# EAGLE design avga (EAGLE 5.09)
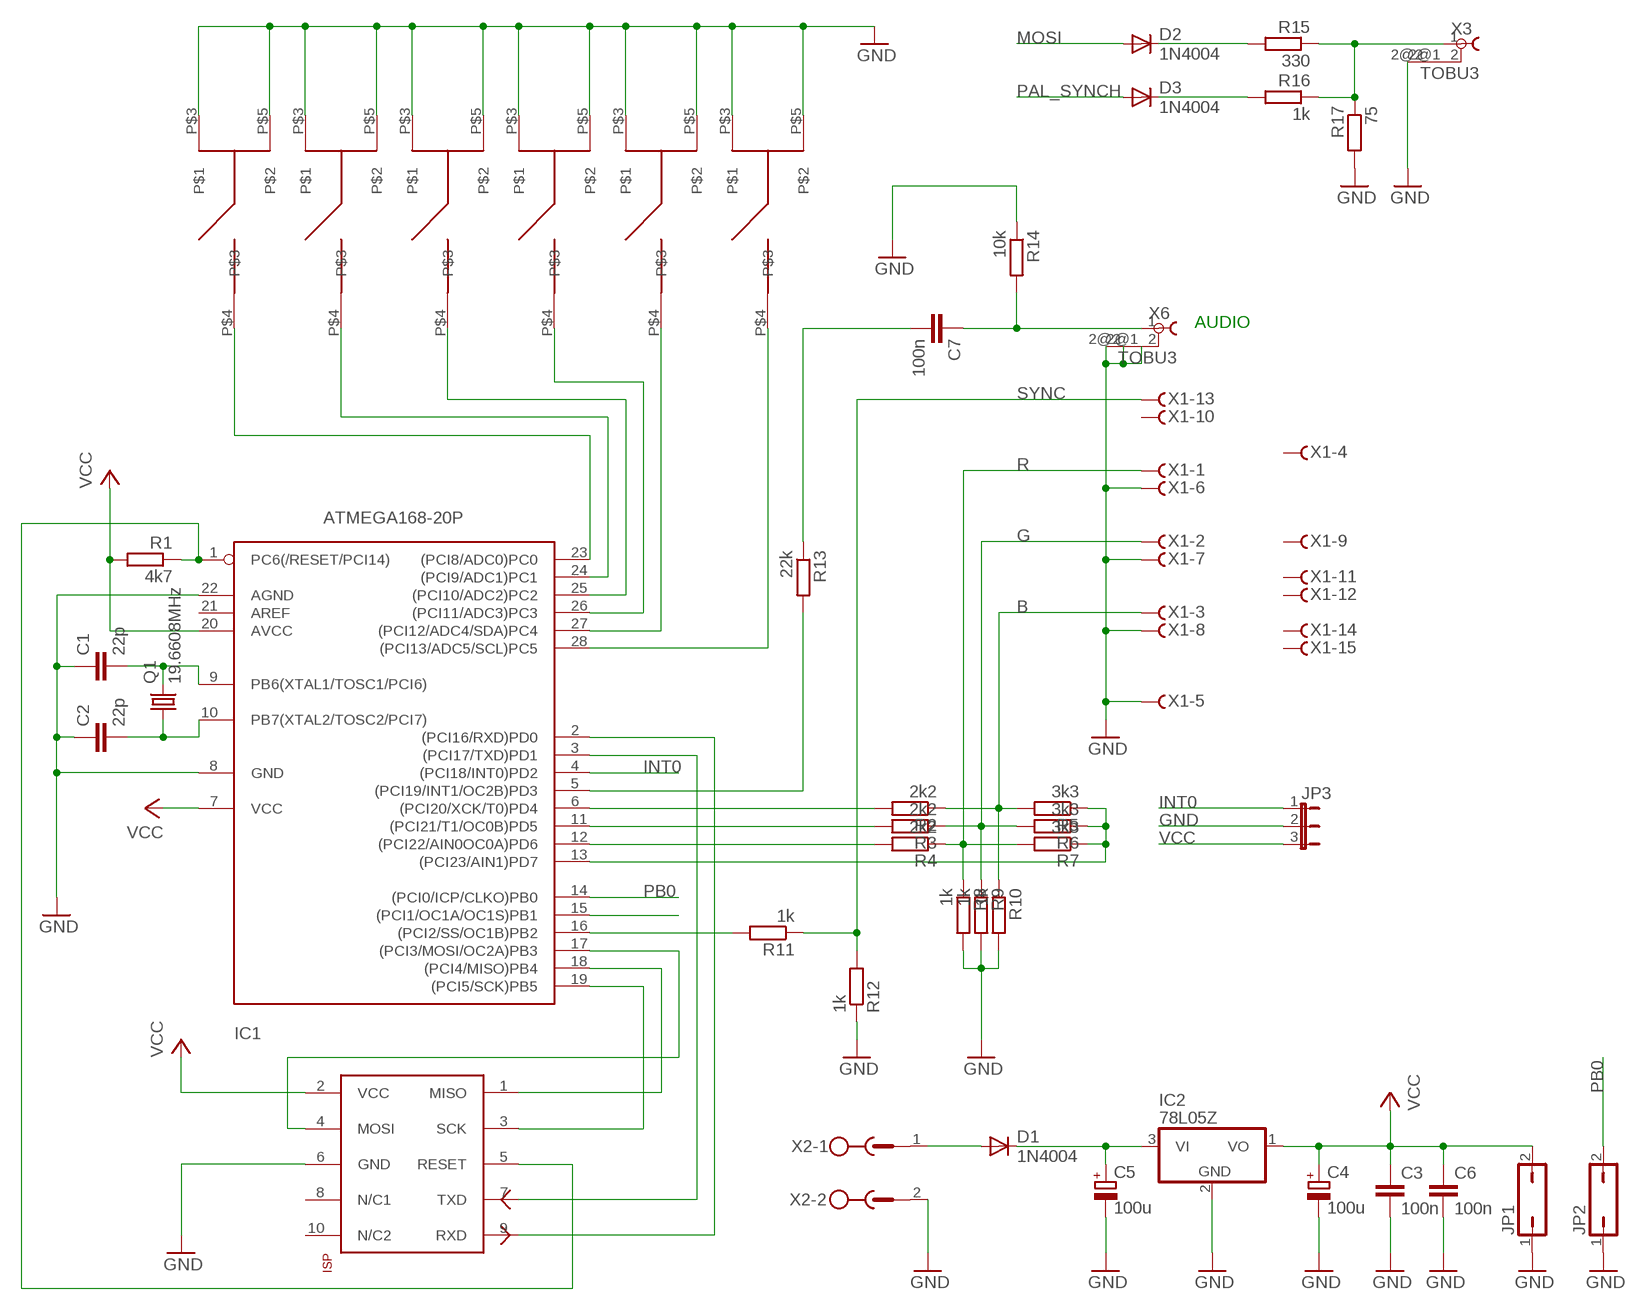
[diagram p0: schematic, sheet 1]

## Parts
C1  22p  C-EU050-025X075  [C050-025X075]
C2  22p  C-EU050-025X075  [C050-025X075]
C3  100n  C-EU050-025X075  [C050-025X075]
C4  100u  CPOL-EUE5-8.5  [E5-8,5]
C5  100u  CPOL-EUE5-8.5  [E5-8,5]
C6  100n  C-EU050-025X075  [C050-025X075]
C7  100n  C-EU050-025X075  [C050-025X075]
D1  1N4004  [DO41-10]
D2  1N4004  [DO41-10]
D3  1N4004  [DO41-10]
IC1  ATMEGA168-20P  [DIL28-3]
IC2  78L05Z  [TO92]
JP1  JP1Q  [JP1]
JP2  JP1Q  [JP1]
JP3  JP2E  [JP2]
Q1  19.6608MHz  CRYTALHC49U-V  [HC49U-V]
R1  4k7  R-EU_0204/7  [0204/7]
R2  2k2  R-EU_0204/7  [0204/7]
R3  2k2  R-EU_0204/7  [0204/7]
R4  2k2  R-EU_0204/7  [0204/7]
R5  3k3  R-EU_0204/7  [0204/7]
R6  3k3  R-EU_0204/7  [0204/7]
R7  3k3  R-EU_0204/7  [0204/7]
R8  1k  R-EU_0204/7  [0204/7]
R9  1k  R-EU_0204/7  [0204/7]
R10  1k  R-EU_0204/7  [0204/7]
R11  1k  R-EU_0204/7  [0204/7]
R12  1k  R-EU_0204/7  [0204/7]
R13  22k  R-EU_0204/7  [0204/7]
R14  10k  R-EU_0204/7  [0204/7]
R15  330  R-EU_0204/7  [0204/7]
R16  1k  R-EU_0204/7  [0204/7]
R17  75  R-EU_0204/7  [0204/7]
U$1  KEYBUTTON  [KEYBUTTON]
U$2  KEYBUTTON  [KEYBUTTON]
U$3  KEYBUTTON  [KEYBUTTON]
U$4  KEYBUTTON  [KEYBUTTON]
U$5  KEYBUTTON  [KEYBUTTON]
U$6  KEYBUTTON  [KEYBUTTON]
U$7  CON-ISP  [CON-ISP]
X1  HF15HS  [HDF15H]
X2  MSTBV2  [MSTBV2]
X3  TOBU3  [TOBU3]
X6  TOBU3  [TOBU3]

## Nets
B: R2.1 R5.2 R10.1 X1.3
G: R3.1 R6.2 R9.1 X1.2
GND: C1.1 C2.1 C3.2 C4.- C5.- C6.2 IC1.8(GND) IC1.22(AGND) IC2.2(GND) JP1.1 JP2.1 JP3.2 R8.2 R9.2 R10.2 R12.1 R14.1 R17.2 U$1.P$3 U$1.P$5 U$2.P$3 U$2.P$5 U$3.P$3 U$3.P$5 U$4.P$3 U$4.P$5 U$5.P$3 U$5.P$5 U$6.P$3 U$6.P$5 U$7.6(GND) X1.5 X1.6 X1.7 X1.8 X2.2 X3.2@2 X6.2 X6.2@1 X6.2@2
INT0: IC1.4((PCI18/INT0)PD2) JP3.1
MC_SYNCH: IC1.16((PCI2/SS/OC1B)PB2) R11.2
MISO: IC1.18((PCI4/MISO)PB4) U$7.1(MISO)
MOSI: D2.A IC1.17((PCI3/MOSI/OC2A)PB3) U$7.4(MOSI)
N$1: C1.2 IC1.9(PB6(XTAL1/TOSC1/PCI6)) Q1.2
N$3: C2.2 IC1.10(PB7(XTAL2/TOSC2/PCI7)) Q1.1
N$4: IC1.11((PCI21/T1/OC0B)PD5) R3.2
N$5: IC1.6((PCI20/XCK/T0)PD4) R2.2
N$6: IC1.12((PCI22/AIN0OC0A)PD6) R4.2
N$7: IC1.13((PCI23/AIN1)PD7) R5.1 R6.1 R7.1
N$8: D1.A X2.1
N$9: IC1.23((PCI8/ADC0)PC0) U$6.P$4
N$10: IC1.24((PCI9/ADC1)PC1) U$5.P$4
N$11: IC1.25((PCI10/ADC2)PC2) U$4.P$4
N$12: C5.+ D1.C IC2.3(VI)
N$13: IC1.26((PCI11/ADC3)PC3) U$3.P$4
N$15: IC1.27((PCI12/ADC4/SDA)PC4) U$2.P$4
N$16: IC1.28((PCI13/ADC5/SCL)PC5) U$1.P$4
N$17: IC1.5((PCI19/INT1/OC2B)PD3) R13.2
N$18: C7.2 R13.1
N$19: C7.1 R14.2 X6.1
N$20: D2.C R15.2
N$21: D3.C R16.2
N$22: R15.1 R16.1 R17.1 X3.1
PAL_SYNCH: D3.A IC1.15((PCI1/OC1A/OC1S)PB1)
PB0: IC1.14((PCI0/ICP/CLKO)PB0) JP2.2
R: R4.1 R7.2 R8.1 X1.1
RESET: IC1.1(PC6(/RESET/PCI14)) R1.1 U$7.5(RESET)
RXD: IC1.2((PCI16/RXD)PD0) U$7.9(RXD)
SCK: IC1.19((PCI5/SCK)PB5) U$7.3(SCK)
SYNC: R11.1 R12.2 X1.13
TXD: IC1.3((PCI17/TXD)PD1) U$7.7(TXD)
VCC: C3.1 C4.+ C6.1 IC1.7(VCC) IC1.20(AVCC) IC2.1(VO) JP1.2 JP3.3 R1.2 U$7.2(VCC)
Unconnected: IC1.21(AREF) U$7.8(N/C1) U$7.10(N/C2) X1.4 X1.9 X1.10 X1.11 X1.12 X1.14 X1.15 X3.2 X3.2@1

## Notes on the sheet
- AUDIO

## Library data of the parts
C1-C3 C6 C7 = rcl:C-EU: CAPACITOR, European symbol
C4 C5 = rcl:CPOL-EU: POLARIZED CAPACITOR, European symbol
D1-D3 = diode:1N4004: DIODE general purpose rectifier, 1 A
IC1 = avr:ATMEGA168*P: MICROCONTROLLER 16 kBytes FLASH 1 kBytes SRAM 512 Bytes EEPROM USART 8-channel 10 bit ADC
IC2 = linear:78*: Positive VOLTAGE REGULATOR
JP1 JP2 = jumper:JP1Q: JUMPER
JP3 = jumper:JP2E: JUMPER
Q1 = crystal:CRYTAL: CRYSTAL
R1-R17 = rcl:R-EU_: RESISTOR, European symbol
U$1-U$6 = keybutton:KEYBUTTON
U$7 = con-isp:CON-ISP
X1 = con-subd:HF15?S: SUB-D
X2 = con-phoenix-500:MSTBV2: PHOENIX
X3 X6 = con-hirschmann:TOBU3: Female Cinch CONNECTOR

## Board
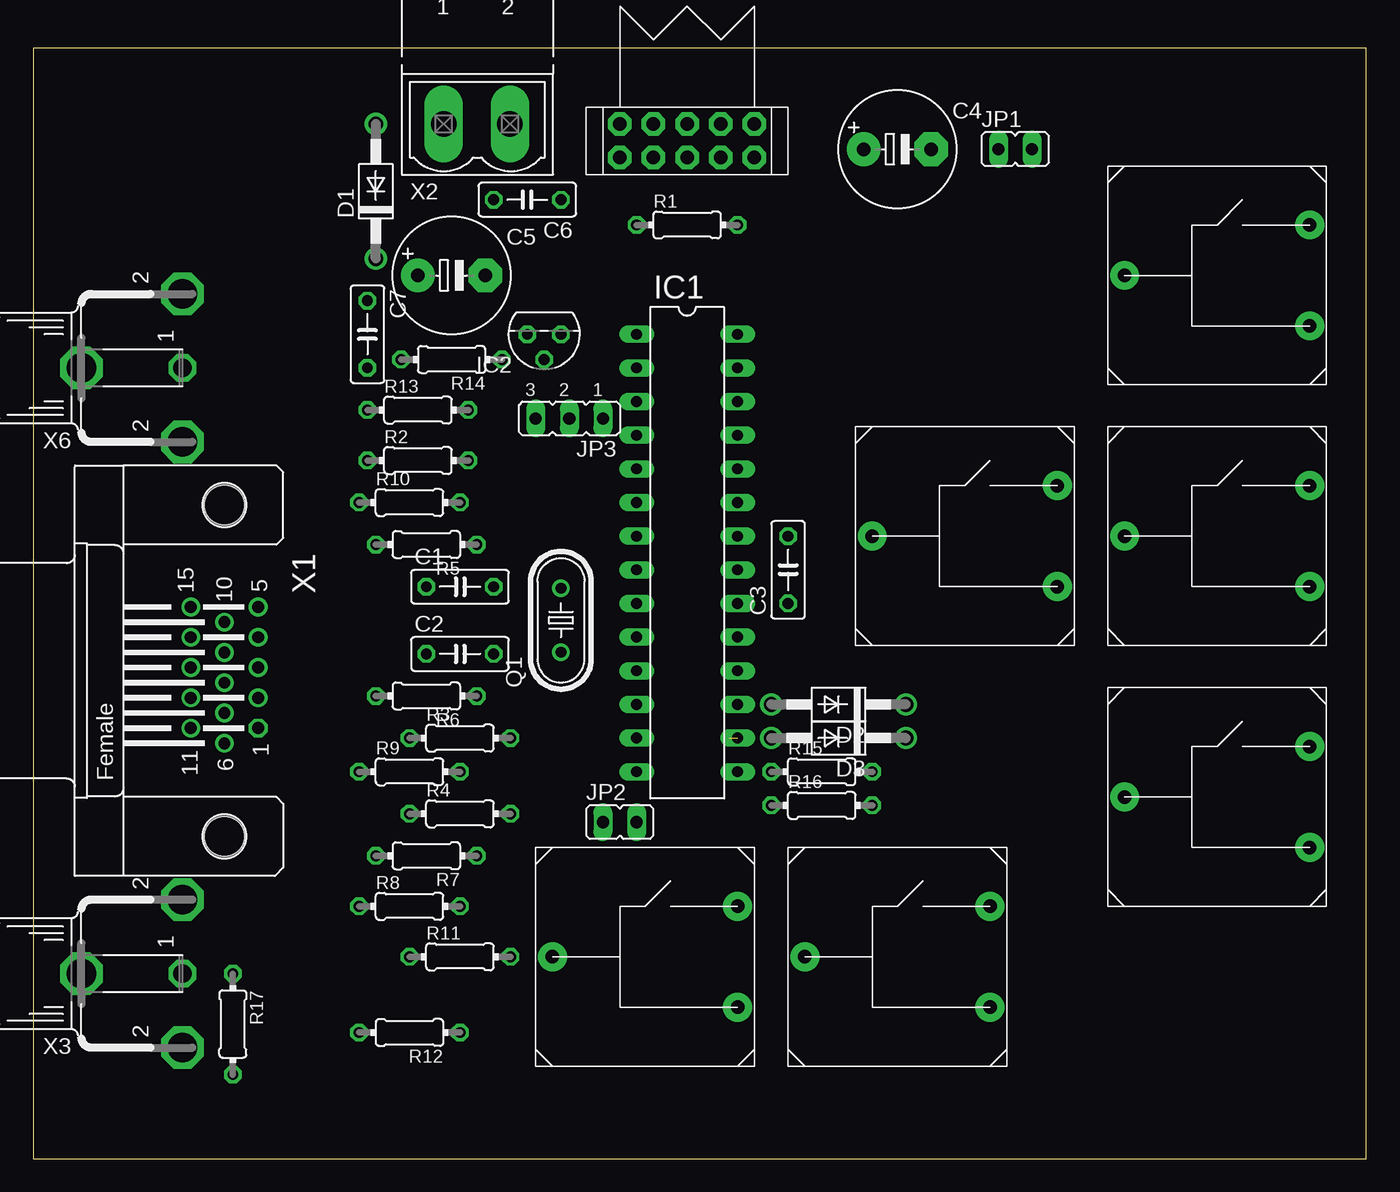
[diagram p1: board, top side]
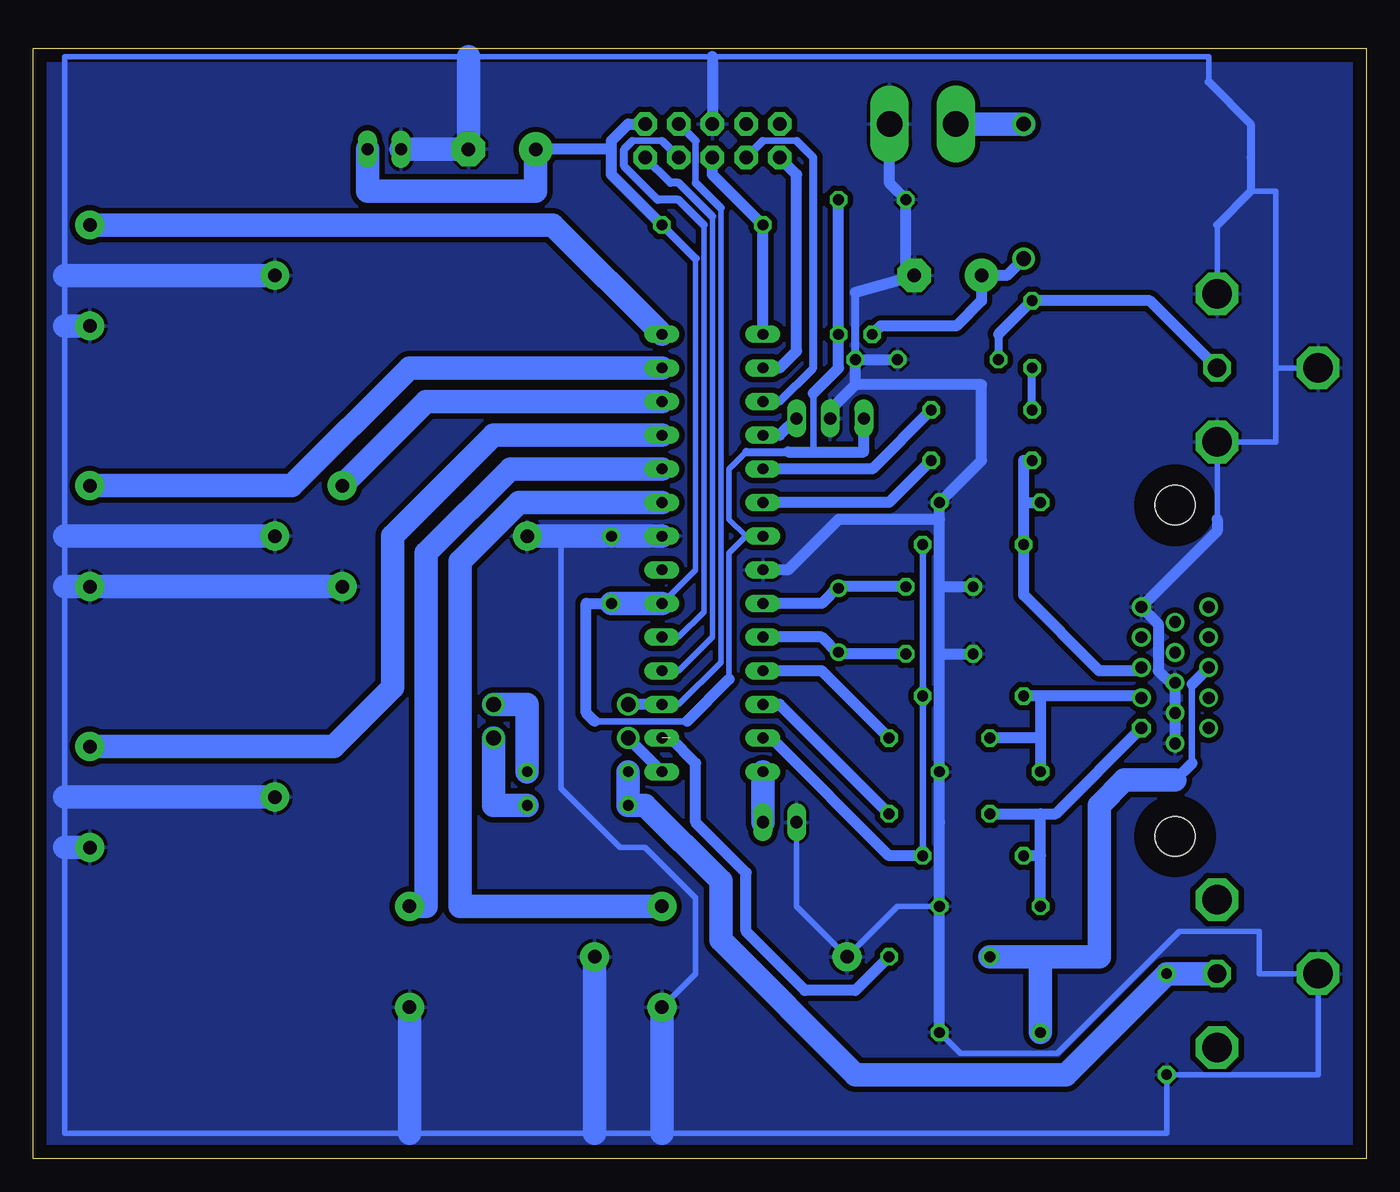
[diagram p2: board, bottom side, seen from below]

Size 100.63 x 83.8 mm. Coordinates in mm from the lower left corner, seen from the top.
Outline: 100.63,0 100.63,83.8 0,83.8 0,0 100.63,0
Copper layers (1*16): Top 0.035mm / dielectric 1.5mm / Bottom 0.035mm
Design rules "default": minimum track width 10mil, minimum drill 24mil, track to track 8mil, track to pad 8mil, pad to pad 8mil, via to via 8mil, smd to smd 8mil, copper to edge 40mil, drill to drill 8mil, minimum pad ring 10mil, minimum via ring 8mil, stop-mask expansion 4mil, vias tented up to drill 0mil, thermal gap 10mil

### Footprints (pad centres in the part's own frame; a part is rotated, then mirrored left to right if it is on the bottom)
C050-025X075 = drill 0.813 octagon: 1 -2.54,0; 2 2.54,0
E5-8,5 = drill 1.016 pad 2.54 round: + -2.54,0 | drill 1.016 pad 2.54 octagon: - 2.54,0
DO41-10 = drill 1.118 round: A 5.08,0; C -5.08,0
DIL28-3 = drill 0.813 long: 1 -16.51,-3.81; 2 -13.97,-3.81; 3 -11.43,-3.81; 4 -8.89,-3.81; 5 -6.35,-3.81; 6 -3.81,-3.81; 7 -1.27,-3.81; 8 1.27,-3.81; 9 3.81,-3.81; 10 6.35,-3.81; 11 8.89,-3.81; 12 11.43,-3.81; 13 13.97,-3.81; 14 16.51,-3.81; 15 16.51,3.81; 16 13.97,3.81; 17 11.43,3.81; 18 8.89,3.81; 19 6.35,3.81; 20 3.81,3.81; 21 1.27,3.81; 22 -1.27,3.81; 23 -3.81,3.81; 24 -6.35,3.81; 25 -8.89,3.81; 26 -11.43,3.81; 27 -13.97,3.81; 28 -16.51,3.81
TO92 = drill 0.813 octagon: 1 -1.27,0; 2 0,1.905; 3 1.27,0
JP1 = drill 0.914 long: 1 0,-1.27; 2 0,1.27
JP2 = drill 0.914 long: 1 -2.54,0; 2 0,0; 3 2.54,0
HC49U-V = drill 0.813 round: 1 -2.413,0; 2 2.413,0
0204/7 = drill 0.813 octagon: 1 -3.81,0; 2 3.81,0
KEYBUTTON = drill 1.016 pad 2.184 round: P$3 -3.81,-6.35; P$4 3.81,-6.35; P$5 0,7.62
CON-ISP = drill 1.016 pad 1.778 octagon: 1 -5.08,1.27; 2 -5.08,-1.27; 3 -2.54,1.27; 4 -2.54,-1.27; 5 0,1.27; 6 0,-1.27; 7 2.54,1.27; 8 2.54,-1.27; 9 5.08,1.27; 10 5.08,-1.27
HDF15H = drill 0.9 octagon: 1 4.329,2.54 | drill 0.9 round: 2 2.043,2.54; 3 -0.243,2.54; 4 -2.529,2.54; 5 -4.815,2.54; 6 5.472,0; 7 3.186,0; 8 0.9,0; 9 -1.386,0; 10 -3.672,0; 11 4.329,-2.54; 12 2.043,-2.54; 13 -0.243,-2.54; 14 -2.529,-2.54; 15 -4.815,-2.54 | hole 3: -12.5,0; 12.5,0
MSTBV2 = drill 1.93 pad 2.184 long: 1 -2.5,0; 2 2.5,0
TOBU3 = drill 1.397 octagon: 1 0,-2.54 | drill 2.21 octagon: 2 5.588,-2.54; 2@1 -5.588,-2.54; 2@2 0,5.08

### Placement (x,y rotation side)
C1  32.22,43.17 0 top
C2  32.22,38.09 0 top
C3  56.98,44.45 90 top
C4  65.24,76.2 0 top
C5  31.58,66.67 0 top
C6  37.3,72.39 180 top
C7  25.23,62.23 270 top
D1  25.87,73.02 90 top
D2  60.8,34.29 180 top
D3  60.8,31.75 180 top
IC1  49.37,45.72 270 top
IC2  38.57,62.23 180 top
JP1  74.13,76.2 270 top
JP2  44.29,25.39 270 top
JP3  40.48,55.88 180 top
Q1  39.84,40.63 90 top
R1  49.37,70.48 0 top
R2  29.04,52.7 0 top
R3  32.22,31.75 0 top
R4  32.22,26.03 0 top
R5  29.68,46.35 180 top
R6  29.68,34.92 180 top
R7  29.68,22.86 180 top
R8  28.41,19.05 0 top
R9  28.41,29.21 0 top
R10  28.41,49.52 0 top
R11  32.22,15.24 0 top
R12  28.41,9.52 180 top
R13  29.04,56.51 0 top
R14  31.58,60.32 180 top
R15  59.52,29.21 0 top
R16  59.52,26.66 0 top
R17  15.07,10.16 270 top
U$1  90,66.67 90 top
U$2  90,46.98 90 top
U$3  70.95,46.98 90 top
U$4  90,27.3 90 top
U$5  65.88,15.24 90 top
U$6  46.83,15.24 90 top
U$7  49.37,76.83 180 top
X1  14.44,36.83 270 top
X2  33.49,78.1 0 top
X3  8.73,13.96 90 top
X6  8.73,59.69 90 top

### Tracks (layer width: path | path; a pad name or v marks a point on that pad's centre or on a via)
B
  Bottom 0.813: R2.1 25.87,52.7 25.87,49.52 | 25.87,49.52 R5.2 25.87,42.54 20.15,36.83 17.22,36.83 X1.3 | 25.87,49.52 R10.1
G
  Bottom 0.406: R6.2 24.6,34.92
  Bottom 0.813: 24.6,31.75 R3.1 | 24.6,31.75 R9.1 | 24.6,34.92 24.6,31.75 | X1.2 17.12,34.92 R6.2
GND
  Bottom 0.406: IC2.2 R14.1 | IC1.22 C3.2 | IC1.22 C3.2 | 11.9,81.28 11.9,83.18 21.43,83.18 49.37,83.18 67.78,83.18 98.26,83.18 98.26,66.67 98.26,62.86 98.26,46.98 98.26,43.17 98.26,27.3 98.26,23.49 98.26,1.9 72.22,1.9 58.26,1.9 53.18,1.9 39.21,1.9 32.22,1.9 15.07,1.9 R17.2 3.65,6.34 X3.2@2 8.09,13.96 8.09,17.14 14.12,17.14 23.33,7.93 30.63,7.93 R12.1 | C3.2 57.62,46.98 | 6.82,59.69 X6.2@2 | 6.82,59.69 6.82,73.02 8.73,73.02 | 6.82,59.69 6.82,54.1 X6.2@1 11.27,53.46 11.27,48.26 | 11.27,70.48 X6.2 | R8.2 35.4,19.05 U$6.P$5 43.02,19.05 JP2.1 | IC1.22 60.8,46.98 60.8,27.94 56.35,23.49 54.45,23.49 50.64,19.68 50.64,15.24 50.64,13.96 U$6.P$3
  Bottom 0.61: IC2.2 38.57,65.4 | 11.9,81.28 8.73,78.1 8.73,75.56 8.73,73.02 11.27,70.48
  Bottom 0.813: 32.22,38.09 32.22,43.17 | 32.22,38.09 R9.2 R8.2 | 32.22,38.09 C2.1 | 32.22,43.17 C1.1 | R8.2 32.22,25.39 | 36.03,76.83 X2.2 35.99,73.61 C6.2 34.76,67.31 C5.- 38.57,65.4 | R12.1 R8.2 | 49.37,83.18 U$7.6 | 32.22,43.17 32.22,48.26 | 32.22,48.26 R10.2 29.04,52.7 29.04,58.41 38.57,58.41 | R14.1 IC2.2 38.57,58.41 | 11.27,48.26 11.27,47.36 X1.5 15.71,40.37 15.71,36.83 14.81,35.92 X1.8 X1.7 X1.6 | 40.48,56.51 JP3.2 40.48,56.51 | 38.57,58.41 40.48,56.51 | IC1.8 43.65,44.45 39.84,48.26 32.22,48.26 | 38.57,58.41 40.48,56.51
  Bottom 1.778: 53.18,1.9 U$6.P$3 | 72.22,1.9 U$5.P$3 | 58.26,1.9 U$5.P$5 | 98.26,27.3 U$4.P$5 | 98.26,23.49 U$4.P$3 | 98.26,43.17 U$2.P$3 U$3.P$3 | 98.26,46.98 U$2.P$5 | 98.26,62.86 U$1.P$3 | 98.26,66.67 U$1.P$5 | 67.78,83.18 C4.- JP1.1 | IC1.22 60.8,46.98 U$3.P$5
  pour Bottom (isolate 0.406): -0.17,-0.01 100.8,-0.01 100.8,84.45 -0.17,84.45
INT0
  Bottom 0.813: IC1.4 44.29,54.61 JP3.1
MC_SYNCH  (1 unrouted)
  Bottom 0.813: 53.81,31.75 52.54,31.75 50.64,29.84 50.64,25.39 46.83,21.59 46.83,17.14 42.38,12.7 38.57,12.7 R11.2
MISO
  Bottom 0.406: IC1.18 51.91,36.83 49.37,39.37 49.37,71.11
  Bottom 0.61: U$7.1 52.54,73.66 51.91,73.66 49.37,71.11
MOSI
  Bottom 0.406: IC1.17 51.91,34.29 48.73,37.46 48.73,71.75
  Bottom 0.508: 50.64,73.66 50.64,76.83
  Bottom 0.61: 48.73,71.75 50.64,73.66 | 50.64,76.83 U$7.4
  Bottom 0.813: IC1.17 D2.A
N$1
  Bottom 0.406: 39.84,43.17 Q1.2
  Bottom 0.813: C1.2 39.84,43.17 41.11,41.91 IC1.9
N$3
  Bottom 0.406: 39.84,38.09 Q1.1
  Bottom 0.813: C2.2 39.84,38.09 41.11,39.37 IC1.10
N$4
  Bottom 0.813: IC1.11 41.11,36.83 R3.2
N$5
  Bottom 0.813: R2.2 36.03,49.52 IC1.6
N$6
  Bottom 0.813: IC1.12 44.29,34.29 R4.2
N$7
  Bottom 0.508: R7.1 R6.1 R5.1
  Bottom 0.813: R7.1 36.03,22.86 44.92,31.75 IC1.13
N$8
  Bottom 1.778: D1.A X2.1
N$9
  Bottom 1.778: U$6.P$4 68.41,19.05 68.41,45.08 63.97,49.52 IC1.23
N$10
  Bottom 0.406: U$5.P$4 71.59,19.05
  Bottom 1.778: IC1.24 64.6,52.06 70.95,45.72 70.95,19.05 71.59,19.05
N$11
  Bottom 1.778: IC1.25 65.88,54.61 73.49,46.98 73.49,35.55 77.94,31.11 U$4.P$4
N$12
  Bottom 0.813: IC2.3 36.66,62.86 30.95,62.86 29.04,64.77 C5.+ 27.14,66.67 D1.C
N$13
  Bottom 1.778: IC1.26 70.95,57.15 U$3.P$4
N$15
  Bottom 1.778: IC1.27 72.22,59.69 81.11,50.8 U$2.P$4
N$16
  Bottom 1.778: U$1.P$4 61.43,70.48 IC1.28
N$17
  Bottom 0.813: IC1.5 37.3,52.06 R13.2
N$18
  Bottom 0.61: R13.1 C7.2
N$19
  Bottom 0.61: 27.78,62.23 R14.2
  Bottom 0.813: 27.78,62.23 C7.1 16.34,64.77 X6.1
N$20
  Bottom 1.778: R15.2 63.34,34.29 D2.C
N$21
  Bottom 1.778: D3.C 65.88,26.66 R16.2
N$22
  Bottom 1.778: X3.1 R17.1 22.7,6.34 38.57,6.34 48.73,16.5 48.73,20.95 54.45,26.66 R16.1 R15.1
PAL_SYNCH
  Bottom 0.813: IC1.15 D3.A
PB0
  Bottom 1.778: JP2.2 IC1.14
R
  Bottom 0.406: 24.6,26.03 R4.1
  Bottom 0.813: R8.1 24.6,22.86 | 24.6,22.86 24.6,26.03 | 24.6,22.86 R7.2 | X1.1 23.45,26.03 R4.1
RESET
  Bottom 0.813: U$7.5 49.37,74.29 R1.1 IC1.1
RXD
  Bottom 0.813: IC1.2 44.29,59.69 43.02,60.95 43.02,74.29 U$7.9
SCK
  Bottom 0.406: IC1.19 51.91,39.37 50,41.27 50,70.48
  Bottom 0.508: 55.4,76.83 53.18,76.83
  Bottom 0.61: 53.18,76.83 U$7.3 | 55.4,76.83 56.03,76.2 56.03,74.92 53.49,72.39 51.91,72.39 50,70.48
SYNC
  Bottom 0.406: 24.6,15.24 R11.1
  Bottom 0.508: 13.17,29.84 13.17,35.8
  Bottom 0.813: 13.17,35.8 X1.13 | 14.44,28.57 13.17,29.84
  Bottom 1.778: R12.2 24.6,15.24 | 14.44,28.57 18.25,28.57 20.15,26.66 20.15,15.24 R11.1
TXD
  Bottom 0.508: 43.02,76.83 45.55,76.83
  Bottom 0.61: 45.55,76.83 U$7.7 | 43.02,76.83 41.75,75.56 41.75,59.69 44.29,57.15 IC1.3
VCC
  Bottom 0.406: IC1.20 50.64,44.45 50.64,67.94 | 46.83,46.98 IC1.7 | 46.83,46.98 48.1,45.72 48.1,36.19 | 46.83,53.34 48.1,52.06 48.1,48.26 46.83,46.98
  Bottom 0.508: 51.27,33.02 58.26,33.02 | 41.75,53.34 41.75,57.78
  Bottom 0.61: 50.64,67.94 R1.2 | 46.83,53.34 43.65,53.34
  Bottom 0.813: R1.2 56.98,74.29 56.98,76.2 | U$7.2 55.72,78.1 56.98,76.83 56.98,76.2 | 51.27,33.02 48.1,36.19 | 58.26,33.02 58.89,33.65 58.89,41.91 IC1.20 | C6.1 IC2.1 39.84,59.69 41.75,57.78 | 56.98,76.2 C4.+ | JP3.3 37.94,53.34 41.75,53.34 43.65,53.34
  Bottom 1.778: IC1.20 C3.1 | JP1.2 75.4,75.56 75.4,73.02 62.7,73.02 C4.+